# Altium project FiltroConGIC.PrjPcb
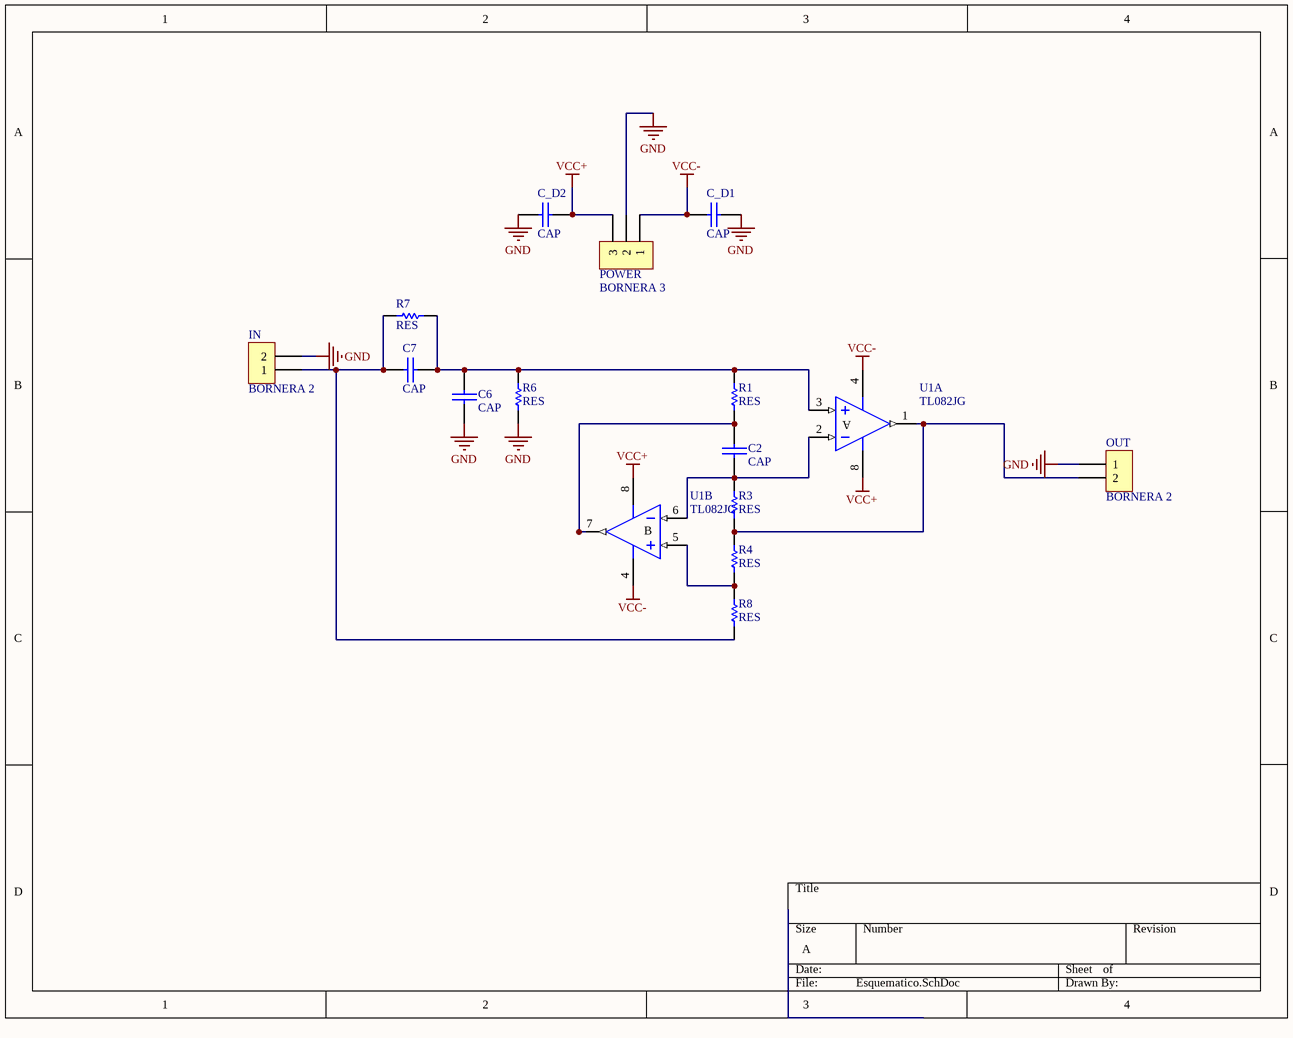
[diagram p0: Esquematico.SchDoc]
1 sheet, 15 parts. Net scope: global (net labels, ports and power ports of the same name join across sheets).
Board file: PCB.PcbDoc

## Sheet Esquematico.SchDoc
size A

### Parts
C2  CAP  [CAP200]
C6  CAP  [CAP200]
C7  CAP  [CAP200]
C_D1  CAP  [0805]
C_D2  CAP  [0805]
IN  BORNERA 2  [BORNERA2]
OUT  BORNERA 2  [BORNERA2]
POWER  BORNERA 3  [BORNERA3]
R1  RES  [RES300]
R3  RES  [RES300]
R4  RES  [RES300]
R6  RES  [RES300]
R7  RES  [RES300]
R8  RES  [RES300]
U1  TL082JG  [JG008]  (parts A,B of 2)

### Nets
GND: C6.1 C_D1.2 C_D2.1 IN.2 OUT.1 POWER.2 R6.1
VCC+: C_D2.2 POWER.3 U1.8(V+)
VCC-: C_D1.1 POWER.1 U1.4(V-)
NetC2_1: C2.1 R1.1 U1.7(OUT)
NetC2_2: C2.2 R3.2 U1.2(IN-) U1.6(IN-)
NetC6_2: C6.2 C7.2 R1.2 R6.2 R7.2 U1.3(IN+)
NetC7_1: C7.1 IN.1 R7.1 R8.1
NetOUT_2: OUT.2 R3.1 R4.2 U1.1(OUT)
NetR4_1: R4.1 R8.2 U1.5(IN+)

### Notes on the sheet
- (in symbol TL082JG, part A) A
- (in symbol TL082JG, part B) B

### Library data of the parts
U1 = TL082JG: JFET-Input Operational Amplifier; Published: 16-Jan-2001; LatestRevisionDate: 04-Mar-2005; LatestRevisionNote: Stylized 3D Model Added.; DatasheetVersion: Feb-1999; PackageVersion: Jan-1995; PackageReference: JG008; Publisher: Altium Limited; PackageDescription: DIP; 8 Leads; Row Spacing 7.62 mm; Pitch 2.54 mm; ComponentLink1Description: Manufacturer Link; ComponentLink1URL: http://www.ti.com/; ComponentLink2Description: Datasheet; ComponentLink2URL: http://www-s.ti.com/sc/ds/tl082.pdf